# Altium project VCO_CtrlBoard.PrjPcb
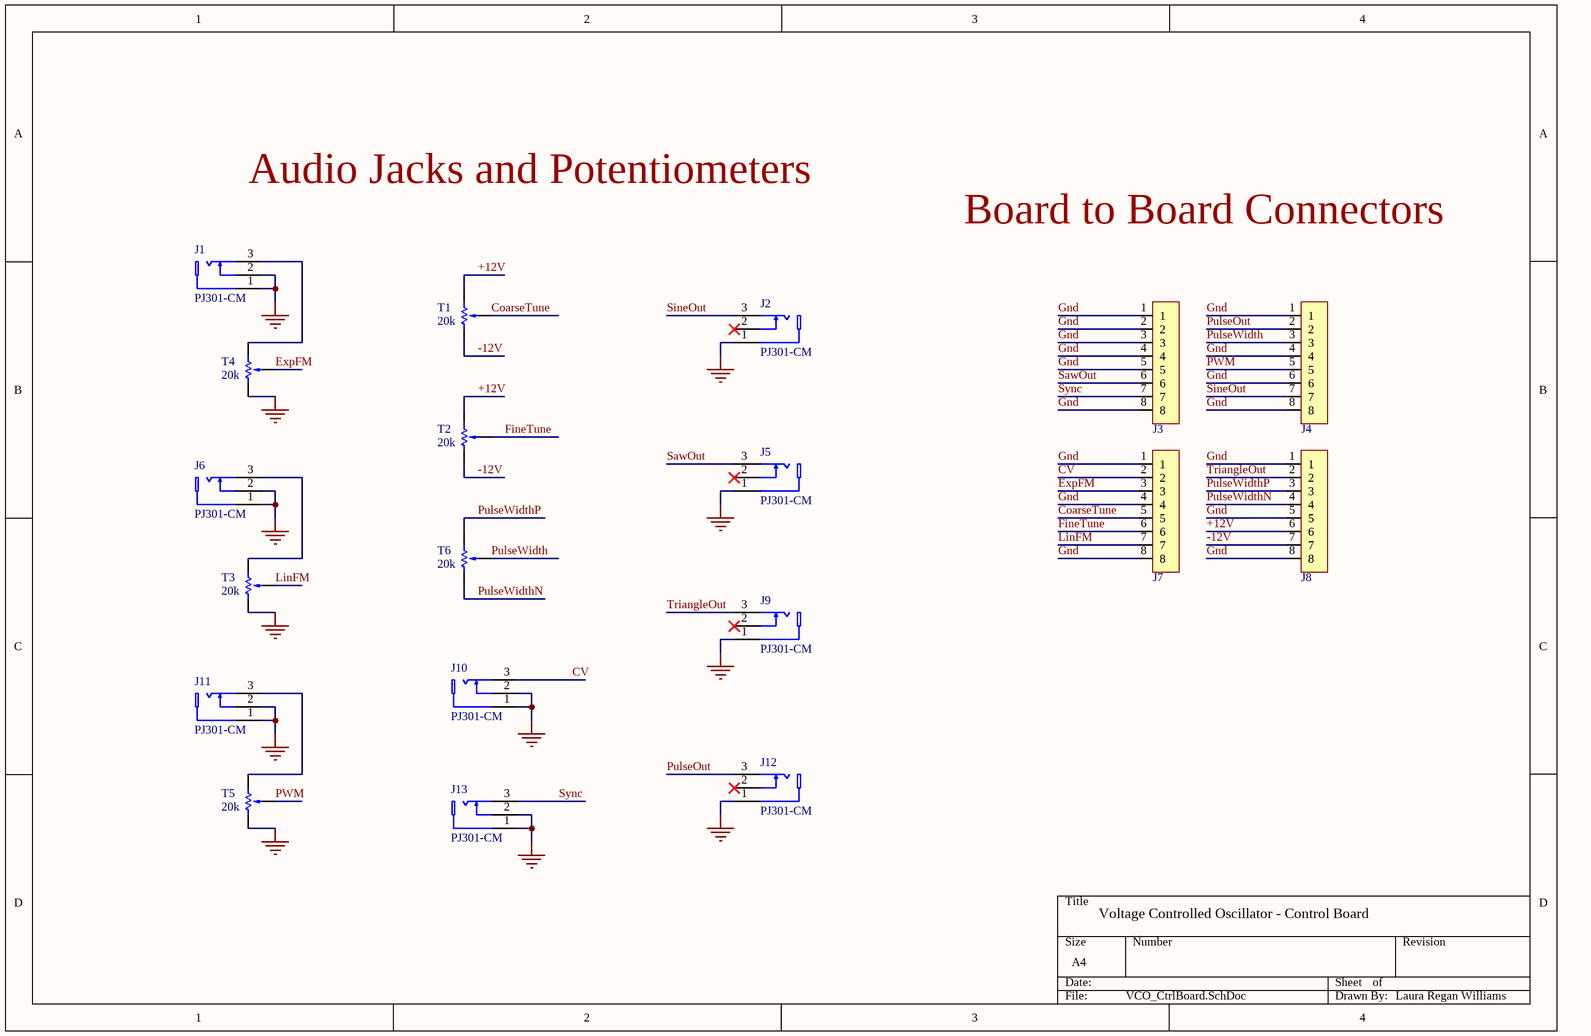
[diagram p0: VCO_CtrlBoard.SchDoc]
1 sheet, 19 parts. Net scope: global (net labels, ports and power ports of the same name join across sheets).
Board file: VCO_CtrlBoard.PcbDoc

## Sheet VCO_CtrlBoard.SchDoc: Voltage Controlled Oscillator - Control Board
size A4; DrawnBy: Laura Regan Williams; SheetNumber: 1; SheetTotal: 1

### Parts
J1  PJ301-CM  [PJ301-M-12]
J2  PJ301-CM  [PJ301-M-12]
J3  HDR F 1x8 2.54MM  [HDR F 1x8 2.54MM]  (value not drawn)
J4  HDR F 1x8 2.54MM  [HDR F 1x8 2.54MM]  (value not drawn)
J5  PJ301-CM  [PJ301-M-12]
J6  PJ301-CM  [PJ301-M-12]
J7  HDR F 1x8 2.54MM  [HDR F 1x8 2.54MM]  (value not drawn)
J8  HDR F 1x8 2.54MM  [HDR F 1x8 2.54MM]  (value not drawn)
J9  PJ301-CM  [PJ301-M-12]
J10  PJ301-CM  [PJ301-M-12]
J11  PJ301-CM  [PJ301-M-12]
J12  PJ301-CM  [PJ301-M-12]
J13  PJ301-CM  [PJ301-M-12]
T1  value 20k  [RV0932]  (hidden comment: RV0932)
T2  value 20k  [RV0932]  (hidden comment: RV0932)
T3  value 20k  [RV0932]  (hidden comment: RV0932)
T4  value 20k  [RV0932]  (hidden comment: RV0932)
T5  value 20k  [RV0932]  (hidden comment: RV0932)
T6  value 20k  [RV0932]  (hidden comment: RV0932)

### Nets
Gnd: J1.1 J1.2 J2.1 J3.1 J3.2 J3.3 J3.4 J3.5 J3.8 J4.1 J4.4 J4.6 J4.8 J5.1 J6.1 J6.2 J7.1 J7.4 J7.8 J8.1 J8.5 J8.8 J9.1 J10.1 J10.2 J11.1 J11.2 J12.1 J13.1 J13.2 T3.3 T4.3 T5.3
+12V: J8.6 T1.1 T2.1
-12V: J8.7 T1.3 T2.3
CoarseTune: J7.5 T1.2
CV: J7.2 J10.3
ExpFM: J7.3 T4.2
FineTune: J7.6 T2.2
LinFM: J7.7 T3.2
PulseOut: J4.2 J12.3
PulseWidth: J4.3 T6.2
PulseWidthN: J8.4 T6.3
PulseWidthP: J8.3 T6.1
PWM: J4.5 T5.2
SawOut: J3.6 J5.3
SineOut: J2.3 J4.7
Sync: J3.7 J13.3
TriangleOut: J8.2 J9.3
NetJ1_3: J1.3 T4.1
NetJ6_3: J6.3 T3.1
NetJ11_3: J11.3 T5.1

Not connected (* = marked no-connect by the designer): J2 2*; J5 2*; J9 2*; J12 2*

### Notes on the sheet
- Audio Jacks and Potentiometers
- Board to Board Connectors

### Library data of the parts
J1 J2 J5 J6 J9-J13 = PJ301-M-12
T1-T6 = Potentiometer: SET: 0.5